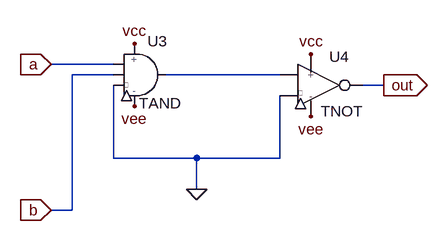
[diagram p0: schematic TNAND.asc]
TNAND.asc, the LTspice schematic file:
Version 4
SHEET 1 1456 780
WIRE -800 -816 -896 -816
WIRE -800 -800 -864 -800
WIRE -544 -800 -720 -800
WIRE -384 -784 -416 -784
WIRE -800 -672 -800 -784
WIRE -672 -672 -800 -672
WIRE -544 -672 -544 -768
WIRE -544 -672 -672 -672
WIRE -672 -624 -672 -672
WIRE -864 -592 -864 -800
WIRE -864 -592 -896 -592
FLAG -896 -816 a
IOPIN -896 -816 In
FLAG -896 -592 b
IOPIN -896 -592 In
FLAG -672 -624 0
FLAG -768 -752 vee
FLAG -496 -736 vee
FLAG -768 -848 vcc
FLAG -496 -832 vcc
FLAG -384 -784 out
IOPIN -384 -784 Out
SYMBOL TAND -752 -800 R0
SYMATTR InstName U3
SYMBOL TNOT -480 -784 R0
SYMATTR InstName U4

The netlist it stands for:
* TNAND.asc
XU3 a b vcc vee N001 0 TAND  ; pins a b vcc vee out gnd
XU4 N001 vcc vee out 0 TNOT  ; pins in vcc vee out gnd
.lib /Users/manoelribeiroalmeida/dev/trit/LTspice/TAND.sub
.lib /Users/manoelribeiroalmeida/dev/trit/LTspice/TNOT.sub
.backanno
.end